# EAGLE design Sensor Acquisition Board Rear rev1 (EAGLE 9.6.2)
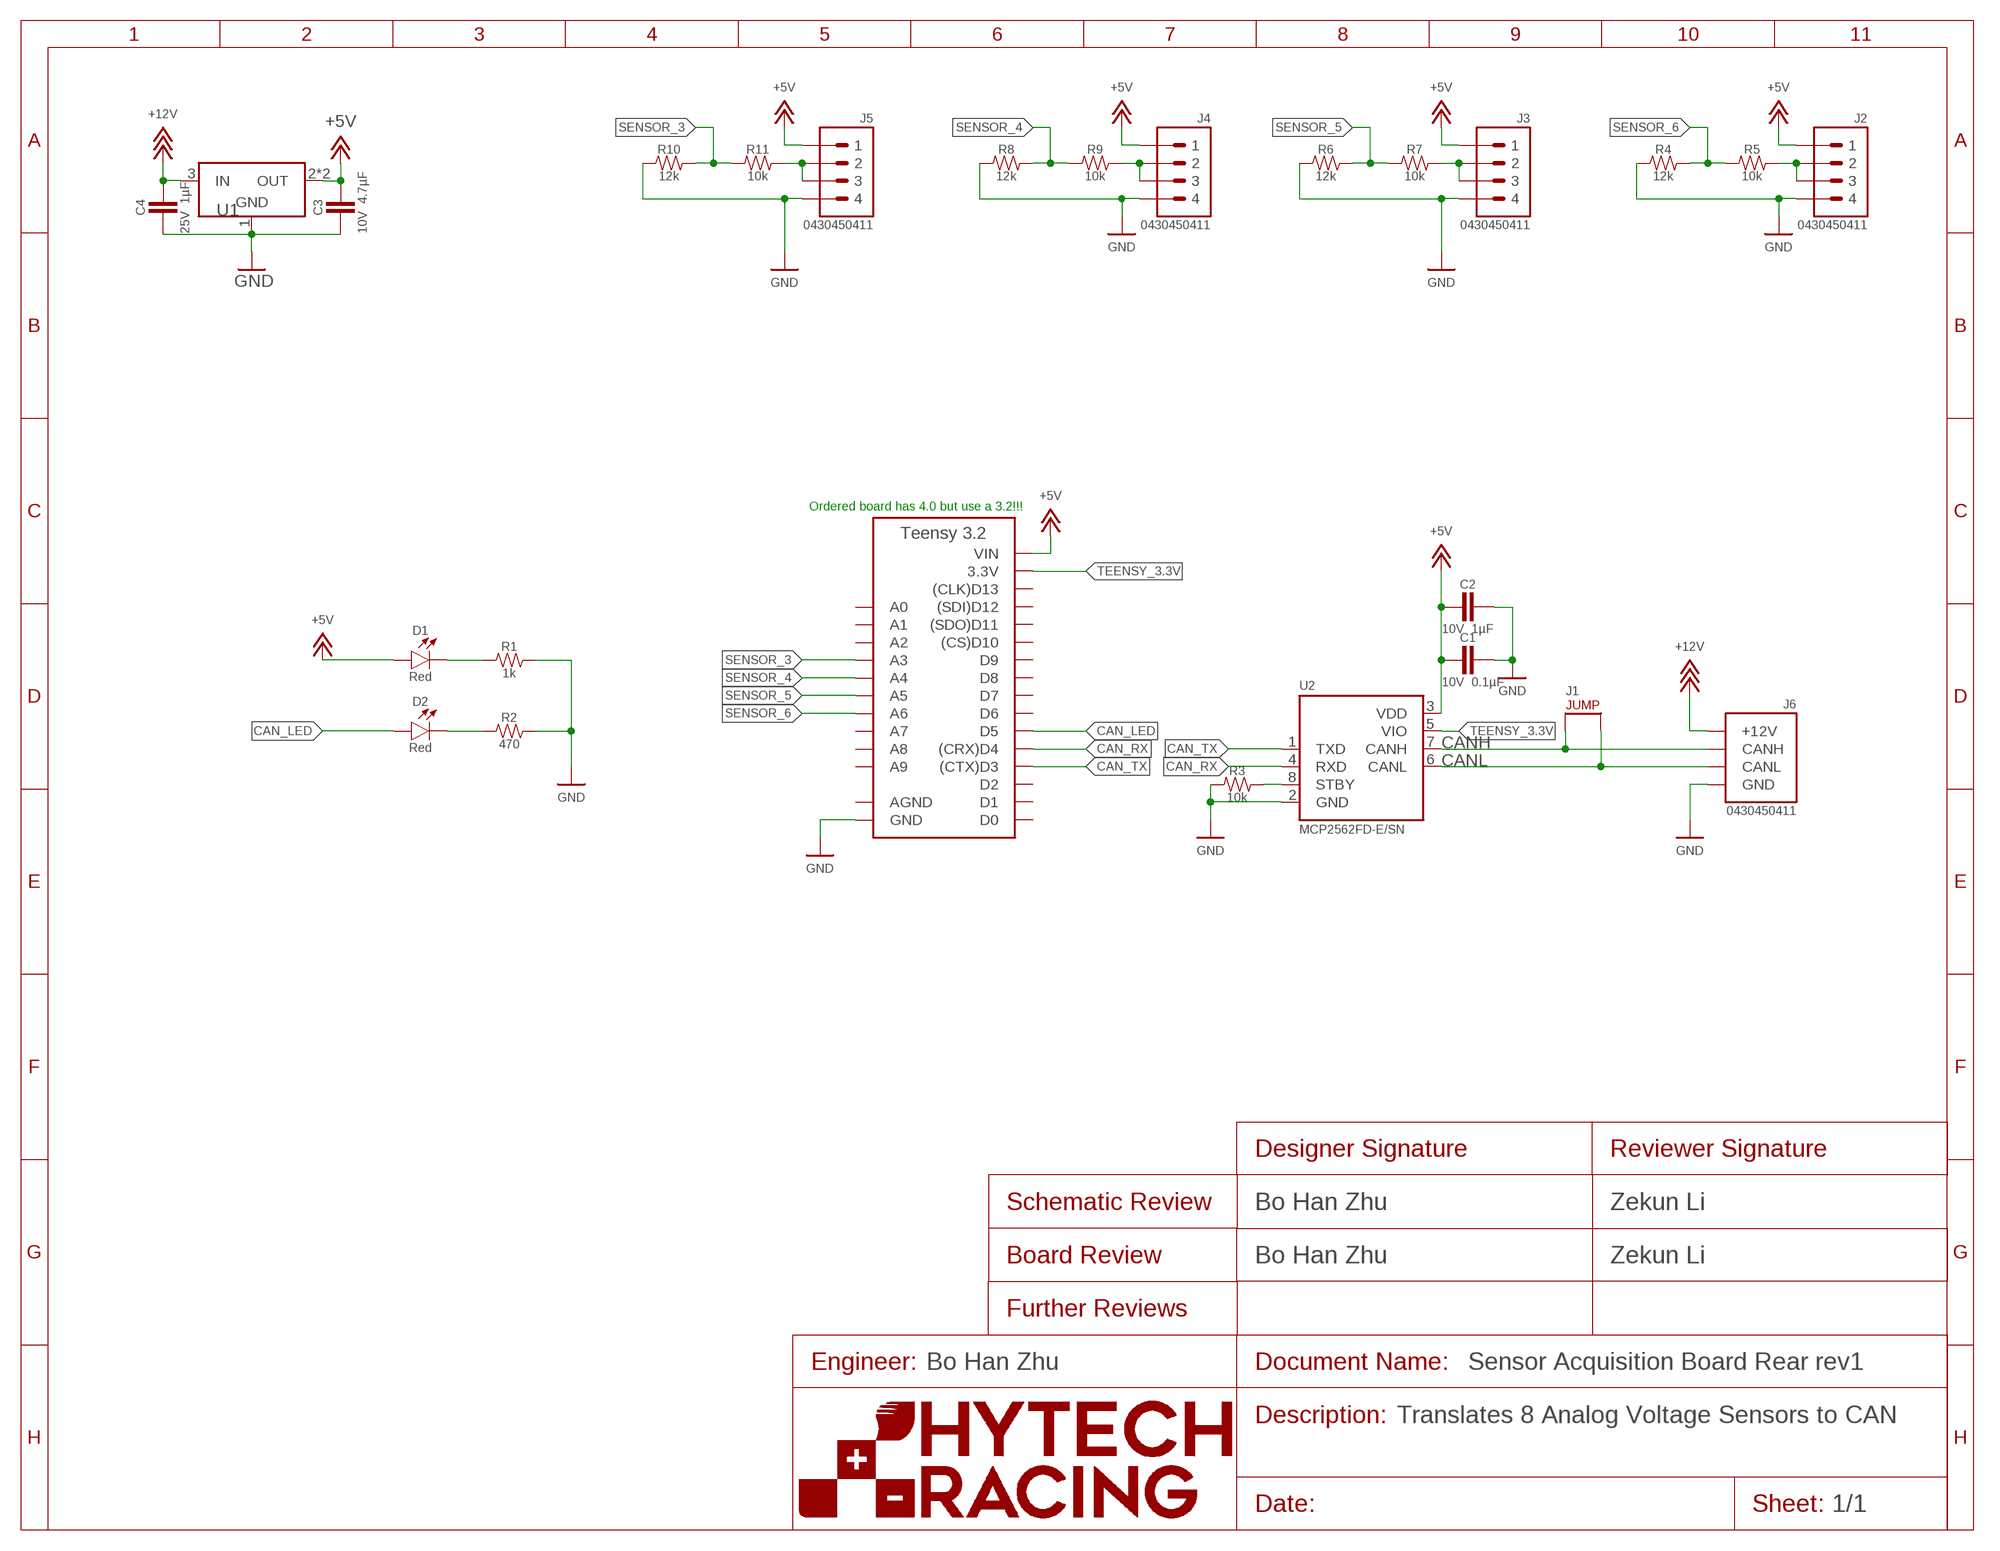
[diagram p0: schematic, sheet 1]
FRAME1 (FRAME): DESCRIPTION_1: Translates 8 Analog Voltage Sensors to CAN; DESIGNER_BOARD: Bo Han Zhu; DESIGNER_SCHEMATIC: Bo Han Zhu; ENGINEER: Bo Han Zhu; REVIEWER_BOARD: Zekun Li; REVIEWER_SCHEMATIC: Zekun Li

## Parts
A1  TEENSY_3.2  [TEENSY_SHORT]
C1  CAPACITOR_0603_10V_0.1UF  [0603-CAP]
C2  CAPACITOR_0603_10V_1UF  [0603-CAP]
C3  CAPACITOR_0603_10V_4.7UF  [0603-CAP]
C4  CAPACITOR_0603_25V_1UF  [0603-CAP]
D1  LED_0603_RED  [0603-LED]
D2  LED_0603_RED  [0603-LED]
J1  JUMPER_0603_  [0603-RES]
J2  CONNECTOR-4_μF_S_RA_  [MOLEX_MICROFIT_SMD_RIGHTANGLE_04_DUAL]
J3  CONNECTOR-4_μF_S_RA_  [MOLEX_MICROFIT_SMD_RIGHTANGLE_04_DUAL]
J4  CONNECTOR-4_μF_S_RA_  [MOLEX_MICROFIT_SMD_RIGHTANGLE_04_DUAL]
J5  CONNECTOR-4_μF_S_RA_  [MOLEX_MICROFIT_SMD_RIGHTANGLE_04_DUAL]
J6  CONNECTOR-CAN_μF_S_RA_  [MOLEX_MICROFIT_SMD_RIGHTANGLE_04_DUAL]
R1  RESISTOR_0603_1K  [0603-RES]
R2  RESISTOR_0603_470  [0603-RES]
R3  RESISTOR_0603_10K  [0603-RES]
R4  RESISTOR_0603_12K  [0603-RES]
R5  RESISTOR_0603_10K  [0603-RES]
R6  RESISTOR_0603_12K  [0603-RES]
R7  RESISTOR_0603_10K  [0603-RES]
R8  RESISTOR_0603_12K  [0603-RES]
R9  RESISTOR_0603_10K  [0603-RES]
R10  RESISTOR_0603_12K  [0603-RES]
R11  RESISTOR_0603_10K  [0603-RES]
U1  VOLTAGE_REGULATOR_SOT-223_5V  [SOT-223]
U2  MCP2562FD  [SOIC-08(NARROW,0.15")]

## Nets
+5V: A1.VIN C1.2 C2.2 C3.1 D1.2(A) J2.1 J3.1 J4.1 J5.1 U1.2(OUT) U1.4(OUT) U2.3(VDD)
+12V: C4.1 J6.1(+12V) U1.3(IN)
CAN_LED: A1.D5 D2.2(A)
CAN_RX: A1.D4((CRX)D4) U2.4(RXD)
CAN_TX: A1.D3((CTX)D3) U2.1(TXD)
CANH: J1.1 J6.4(CANH) U2.7(CANH)
CANL: J1.2 J6.3(CANL) U2.6(CANL)
GND: A1.GND C1.1 C2.1 C3.2 C4.2 J2.4 J3.4 J4.4 J5.4 J6.2(GND) R1.2 R2.2 R3.1 R4.1 R6.1 R8.1 R10.1 U1.1(GND) U2.2(GND)
N$1: D1.1(C) R1.1
N$2: D2.1(C) R2.1
N$3: R3.2 U2.8(STBY)
N$5: J2.2 J2.3 R5.2
N$6: J4.2 J4.3 R9.2
N$7: J3.2 J3.3 R7.2
N$9: J5.2 J5.3 R11.2
SENSOR_3: A1.D17(A3) R10.2 R11.1
SENSOR_4: A1.D18(A4) R8.2 R9.1
SENSOR_5: A1.D19(A5) R6.2 R7.1
SENSOR_6: A1.D20(A6) R4.2 R5.1
TEENSY_3.3V: A1.3.3V U2.5(VIO)
Unconnected: A1.D0 A1.D1 A1.D2 A1.D6 A1.D7 A1.D8 A1.D9 A1.D10((CS)D10) A1.D11((SDO)D11) A1.D12((SDI)D12) A1.D13((CLK)D13) A1.D14(A0) A1.D15(A1) A1.D16(A2) A1.D21(A7) A1.D22(A8) A1.D23(A9)

## Notes on the sheet
- Ordered board has 4.0 but use a 3.2!!!

## Power pins joined to a net without a drawn wire
AGND: A1.AGND/GND(AGND)

## Library data of the parts
A1 = HyTechDevices:TEENSY_3.2: Teensy 3.2 Datasheet <https://www.pjrc.com/store/teensy32.html> Requires ordering of: 2: 14 pin, 0.1" pitch female headers; TEENSY: 3.2
C1 = HyTechDevices:CAPACITOR_?_*: Capacitor, Non-Polarized VJ...1BC Series Datasheet <https://www.mouser.com/datasheet/2/427/vjw1bcbascomseries-1762447.pdf> Samsung Datasheet <https://www.mouser.com/datasheet/2/585/MLCC-1837944.pdf> Walsin Datasheet <https://www.mouser.com/datasheet/2/210/WTC_MLCC_General_Purpose-1534899.pdf> GRM188R61A226ME15D <https://www.mouser.com/datasheet/2/281/1/GRM188R61A226ME15_02A-1985787.pdf> GRM188R61E106MA73D <https://www.mouser.com/datasheet/2/281/1/GRM188R61E106MA73_01A-1985806.pdf> 885012006013 <https://www.mouser.com/datasheet/2/445/885012006013-1726946.pdf> 2220Y6300105KXTWS2 <https://www.mouser.com/datasheet/2/218/SMD_High_and_Std_StackiCap_P62-1825512.pdf> Yageo Class 2, X5R <https://www.mouser.com/datasheet/2/447/UPY_GPHC_X5R_4V_to_50V_26-1827097.pdf> TDK C Series <https://www.mouser.com/ProductDetail/TDK/C3216X5R1V226M160AC?qs=%2Fha2pyFadujbcx9jh7lYl%2F4NeMoXFhdc8AqVWNq4wW6M2y7zl6GzBuhgtI0ngznN> AVX Automotive MLCC <https://www.mouser.com/datasheet/2/40/AutoMLCC-777028.pdf> KEMET X7R Series <https://www.mouser.com/datasheet/2/212/KEM_C1002_X7R_SMD-1102033.pdf> Kyocera AVX <https://www.mouser.com/datasheet/2/40/C0GNP0_Dielectric-951274.pdf>; CAPACITANCE: 0.1µF; DKPN: 720-1688-1-ND; MANUFACTURER: Vishay Vitramon; MOPN: 77-VJ0603Y104JXQPBC; MPN: VJ0603Y104JXQPW1BC; TOLERANCE: 5%; VOLTAGE: 10V
C2 = HyTechDevices:CAPACITOR_?_*: Capacitor, Non-Polarized VJ...1BC Series Datasheet <https://www.mouser.com/datasheet/2/427/vjw1bcbascomseries-1762447.pdf> Samsung Datasheet <https://www.mouser.com/datasheet/2/585/MLCC-1837944.pdf> Walsin Datasheet <https://www.mouser.com/datasheet/2/210/WTC_MLCC_General_Purpose-1534899.pdf> GRM188R61A226ME15D <https://www.mouser.com/datasheet/2/281/1/GRM188R61A226ME15_02A-1985787.pdf> GRM188R61E106MA73D <https://www.mouser.com/datasheet/2/281/1/GRM188R61E106MA73_01A-1985806.pdf> 885012006013 <https://www.mouser.com/datasheet/2/445/885012006013-1726946.pdf> 2220Y6300105KXTWS2 <https://www.mouser.com/datasheet/2/218/SMD_High_and_Std_StackiCap_P62-1825512.pdf> Yageo Class 2, X5R <https://www.mouser.com/datasheet/2/447/UPY_GPHC_X5R_4V_to_50V_26-1827097.pdf> TDK C Series <https://www.mouser.com/ProductDetail/TDK/C3216X5R1V226M160AC?qs=%2Fha2pyFadujbcx9jh7lYl%2F4NeMoXFhdc8AqVWNq4wW6M2y7zl6GzBuhgtI0ngznN> AVX Automotive MLCC <https://www.mouser.com/datasheet/2/40/AutoMLCC-777028.pdf> KEMET X7R Series <https://www.mouser.com/datasheet/2/212/KEM_C1002_X7R_SMD-1102033.pdf> Kyocera AVX <https://www.mouser.com/datasheet/2/40/C0GNP0_Dielectric-951274.pdf>; CAPACITANCE: 1µF; DKPN: 311-1796-1-ND; MANUFACTURER: Yageo; MOPN: 603-CC603KRX7R6BB105; MPN: CC0603KRX7R6BB105; TOLERANCE: 10%; VOLTAGE: 10V
C3 = HyTechDevices:CAPACITOR_?_*: Capacitor, Non-Polarized VJ...1BC Series Datasheet <https://www.mouser.com/datasheet/2/427/vjw1bcbascomseries-1762447.pdf> Samsung Datasheet <https://www.mouser.com/datasheet/2/585/MLCC-1837944.pdf> Walsin Datasheet <https://www.mouser.com/datasheet/2/210/WTC_MLCC_General_Purpose-1534899.pdf> GRM188R61A226ME15D <https://www.mouser.com/datasheet/2/281/1/GRM188R61A226ME15_02A-1985787.pdf> GRM188R61E106MA73D <https://www.mouser.com/datasheet/2/281/1/GRM188R61E106MA73_01A-1985806.pdf> 885012006013 <https://www.mouser.com/datasheet/2/445/885012006013-1726946.pdf> 2220Y6300105KXTWS2 <https://www.mouser.com/datasheet/2/218/SMD_High_and_Std_StackiCap_P62-1825512.pdf> Yageo Class 2, X5R <https://www.mouser.com/datasheet/2/447/UPY_GPHC_X5R_4V_to_50V_26-1827097.pdf> TDK C Series <https://www.mouser.com/ProductDetail/TDK/C3216X5R1V226M160AC?qs=%2Fha2pyFadujbcx9jh7lYl%2F4NeMoXFhdc8AqVWNq4wW6M2y7zl6GzBuhgtI0ngznN> AVX Automotive MLCC <https://www.mouser.com/datasheet/2/40/AutoMLCC-777028.pdf> KEMET X7R Series <https://www.mouser.com/datasheet/2/212/KEM_C1002_X7R_SMD-1102033.pdf> Kyocera AVX <https://www.mouser.com/datasheet/2/40/C0GNP0_Dielectric-951274.pdf>; CAPACITANCE: 4.7µF; DKPN: 1276-1044-1-ND; MANUFACTURER: Samsung Electro-Mechanics; MOPN: 187-CL10A475KP8NNNC; MPN: CL10A475KP8NNNC; TOLERANCE: 10%; VOLTAGE: 10V
C4 = HyTechDevices:CAPACITOR_?_*: Capacitor, Non-Polarized VJ...1BC Series Datasheet <https://www.mouser.com/datasheet/2/427/vjw1bcbascomseries-1762447.pdf> Samsung Datasheet <https://www.mouser.com/datasheet/2/585/MLCC-1837944.pdf> Walsin Datasheet <https://www.mouser.com/datasheet/2/210/WTC_MLCC_General_Purpose-1534899.pdf> GRM188R61A226ME15D <https://www.mouser.com/datasheet/2/281/1/GRM188R61A226ME15_02A-1985787.pdf> GRM188R61E106MA73D <https://www.mouser.com/datasheet/2/281/1/GRM188R61E106MA73_01A-1985806.pdf> 885012006013 <https://www.mouser.com/datasheet/2/445/885012006013-1726946.pdf> 2220Y6300105KXTWS2 <https://www.mouser.com/datasheet/2/218/SMD_High_and_Std_StackiCap_P62-1825512.pdf> Yageo Class 2, X5R <https://www.mouser.com/datasheet/2/447/UPY_GPHC_X5R_4V_to_50V_26-1827097.pdf> TDK C Series <https://www.mouser.com/ProductDetail/TDK/C3216X5R1V226M160AC?qs=%2Fha2pyFadujbcx9jh7lYl%2F4NeMoXFhdc8AqVWNq4wW6M2y7zl6GzBuhgtI0ngznN> AVX Automotive MLCC <https://www.mouser.com/datasheet/2/40/AutoMLCC-777028.pdf> KEMET X7R Series <https://www.mouser.com/datasheet/2/212/KEM_C1002_X7R_SMD-1102033.pdf> Kyocera AVX <https://www.mouser.com/datasheet/2/40/C0GNP0_Dielectric-951274.pdf>; CAPACITANCE: 1µF; DKPN: 1276-1184-1-ND; MANUFACTURER: Samsung Electro-Mechanics; MOPN: 187-CL10B105KA8NNNC; MPN: CL10B105KA8NNNC; TOLERANCE: 10%; VOLTAGE: 25V
D1 D2 = HyTechDevices:LED_?_*: LED 0603 Blue <https://www.mouser.com/datasheet/2/216/APT1608VBC_D-246010.pdf> Green <https://www.mouser.com/datasheet/2/216/APT1608ZGCK-1173388.pdf> Orange <https://www.mouser.com/datasheet/2/216/APT1608SECK-6197.pdf> Red <https://www.mouser.com/datasheet/2/216/APT1608SECK-J3-PRV-1173336.pdf> White <https://www.mouser.com/datasheet/2/50/SM0603UWC-880813.pdf> Yellow <https://www.mouser.com/datasheet/2/216/APT1608SYCK-J3-PRV-1173311.pdf> 2835 (Series not on Digikey) Lumiled LUXEON 2835 Color Line <https://www.mouser.com/datasheet/2/602/DS236_luxeon_2835_color_line_datasheet-1596094.pdf>; COLOR: Red; DKPN: 754-1786-1-ND; MANUFACTURER: Kingbright; MOPN: 604-APT1608SECKJ3PRV; MPN: APT1608SECK/J3-PRV
J1 = HyTechDevices:JUMPER_?_*: 2 Pin Connector; DKPN: 13-RC0603FR-130RLTR-ND; MANUFACTURER: YAGEO; MOPN: 603-RC0603FR-130RL; MPN: RC0603FR-130RL
J2-J5 = HyTechDevices:CONNECTOR-4_?_*; DKPN: WM1832CT-ND; MANUFACTURER: Molex; MOPN: 538-0430450411; MPN: 0430450411
J6 = HyTechDevices:CONNECTOR-CAN_?_*: HyTech CAN Connector; DKPN: WM1832CT-ND; MANUFACTURER: Molex; MOPN: 538-43045-0411; MPN: 0430450411
R1 = HyTechDevices:RESISTOR_?_*: Resistor PWR163 Series <https://www.mouser.com/datasheet/2/54/pwr163-777985.pdf> AC Series <https://www.mouser.com/datasheet/2/447/Yageo_PYu_AC_51_RoHS_L_7_1714230-1874691.pdf> PU Series <https://www.mouser.com/datasheet/2/447/PYu-PU_51_RoHS_L_6-1504619.pdf> ERA Series <https://www.mouser.com/datasheet/2/315/AOA0000C307-1149632.pdf> PWR263 Series <https://www.mouser.com/datasheet/2/54/pwr263s_35-778069.pdf> RC Series <https://www.mouser.com/datasheet/2/447/Yageo_03_18_2021_PYu_RC_Group_51_RoHS_L_11-2199992.pdf> ERJ PB3, PB6 Series <https://www.mouser.com/datasheet/2/315/AOA0000C328-1530132.pdf> ERJ PA2, P03, PA3, P06, P08, P14 Series <https://www.mouser.com/datasheet/2/315/AOA0000C331-1141874.pdf>; DKPN: 311-1.00KHRCT-ND; MANUFACTURER: Yageo; MOPN: 603-RC0603FR-071KL; MPN: RC0603FR-071KL; POWER: 0.1W; RESISTANCE: 1k; TOLERANCE: 1%; VOLTAGE_CONTINUOUS: 10.00V; VOLTAGE_MAX: 75V
R2 = HyTechDevices:RESISTOR_?_*: Resistor PWR163 Series <https://www.mouser.com/datasheet/2/54/pwr163-777985.pdf> AC Series <https://www.mouser.com/datasheet/2/447/Yageo_PYu_AC_51_RoHS_L_7_1714230-1874691.pdf> PU Series <https://www.mouser.com/datasheet/2/447/PYu-PU_51_RoHS_L_6-1504619.pdf> ERA Series <https://www.mouser.com/datasheet/2/315/AOA0000C307-1149632.pdf> PWR263 Series <https://www.mouser.com/datasheet/2/54/pwr263s_35-778069.pdf> RC Series <https://www.mouser.com/datasheet/2/447/Yageo_03_18_2021_PYu_RC_Group_51_RoHS_L_11-2199992.pdf> ERJ PB3, PB6 Series <https://www.mouser.com/datasheet/2/315/AOA0000C328-1530132.pdf> ERJ PA2, P03, PA3, P06, P08, P14 Series <https://www.mouser.com/datasheet/2/315/AOA0000C331-1141874.pdf>; DKPN: P470BYCT-ND; MANUFACTURER: Panasonic Electronic Components; MOPN: 667-ERJ-PA3F4700V; MPN: ERJ-PA3F4700V; POWER: 0.25W; RESISTANCE: 470; TOLERANCE: 1%; VOLTAGE_CONTINUOUS: 10.84V; VOLTAGE_MAX: 150V
R3 R5 R7 R9 R11 = HyTechDevices:RESISTOR_?_*: Resistor PWR163 Series <https://www.mouser.com/datasheet/2/54/pwr163-777985.pdf> AC Series <https://www.mouser.com/datasheet/2/447/Yageo_PYu_AC_51_RoHS_L_7_1714230-1874691.pdf> PU Series <https://www.mouser.com/datasheet/2/447/PYu-PU_51_RoHS_L_6-1504619.pdf> ERA Series <https://www.mouser.com/datasheet/2/315/AOA0000C307-1149632.pdf> PWR263 Series <https://www.mouser.com/datasheet/2/54/pwr263s_35-778069.pdf> RC Series <https://www.mouser.com/datasheet/2/447/Yageo_03_18_2021_PYu_RC_Group_51_RoHS_L_11-2199992.pdf> ERJ PB3, PB6 Series <https://www.mouser.com/datasheet/2/315/AOA0000C328-1530132.pdf> ERJ PA2, P03, PA3, P06, P08, P14 Series <https://www.mouser.com/datasheet/2/315/AOA0000C331-1141874.pdf>; DKPN: 311-10.0KHRCT-ND; MANUFACTURER: Yageo; MOPN: 603-RC0603FR-0710KL; MPN: RC0603FR-0710KL; POWER: 0.1W; RESISTANCE: 10k; TOLERANCE: 1%; VOLTAGE_CONTINUOUS: 31.62V; VOLTAGE_MAX: 75V
R4 R6 R8 R10 = HyTechDevices:RESISTOR_?_*: Resistor PWR163 Series <https://www.mouser.com/datasheet/2/54/pwr163-777985.pdf> AC Series <https://www.mouser.com/datasheet/2/447/Yageo_PYu_AC_51_RoHS_L_7_1714230-1874691.pdf> PU Series <https://www.mouser.com/datasheet/2/447/PYu-PU_51_RoHS_L_6-1504619.pdf> ERA Series <https://www.mouser.com/datasheet/2/315/AOA0000C307-1149632.pdf> PWR263 Series <https://www.mouser.com/datasheet/2/54/pwr263s_35-778069.pdf> RC Series <https://www.mouser.com/datasheet/2/447/Yageo_03_18_2021_PYu_RC_Group_51_RoHS_L_11-2199992.pdf> ERJ PB3, PB6 Series <https://www.mouser.com/datasheet/2/315/AOA0000C328-1530132.pdf> ERJ PA2, P03, PA3, P06, P08, P14 Series <https://www.mouser.com/datasheet/2/315/AOA0000C331-1141874.pdf>; DKPN: 311-12.0KHRCT-ND; MANUFACTURER: Yageo; MOPN: 603-RC0603FR-0712KL; MPN: RC0603FR-0712KL; POWER: 0.1W; RESISTANCE: 12k; TOLERANCE: 1%; VOLTAGE_CONTINUOUS: 34.64V; VOLTAGE_MAX: 75V
U1 = HyTechDevices:VOLTAGE_REGULATOR_?_*: Voltage Regulators LDL1117S50R Datasheet <https://www.mouser.com/datasheet/2/389/dm00366442-1799212.pdf> NCP785AH120T1G <https://www.mouser.com/datasheet/2/308/NCP785A_D-1812704.pdf> LMS8117A Datasheet <https://www.ti.com/lit/ds/symlink/lms8117a.pdf?HQS>; DKPN: 497-17240-1-ND; MANUFACTURER: STMicroelectronics; MOPN: 511-LDL1117S50R; MPN: LDL1117S50R
U2 = HyTechDevices:MCP2562FD: MCP2562FD Can Tranciever Datasheet <https://ww1.microchip.com/downloads/en/DeviceDoc/20005284A.pdf>; ALT_DKPN: MCP2562-E/SN-ND; ALT_MANUFACTURER: Microchip Technology; ALT_MOPN: 579-MCP2562-E/SN; ALT_MPN: MCP2562-E/SN; DKPN: MCP2562FD-E/SN-ND; MANUFACTURER: Microchip Technology; MOPN: 579-MCP2562FD-E/SN; MPN: MCP2562FD-E/SN

## Board
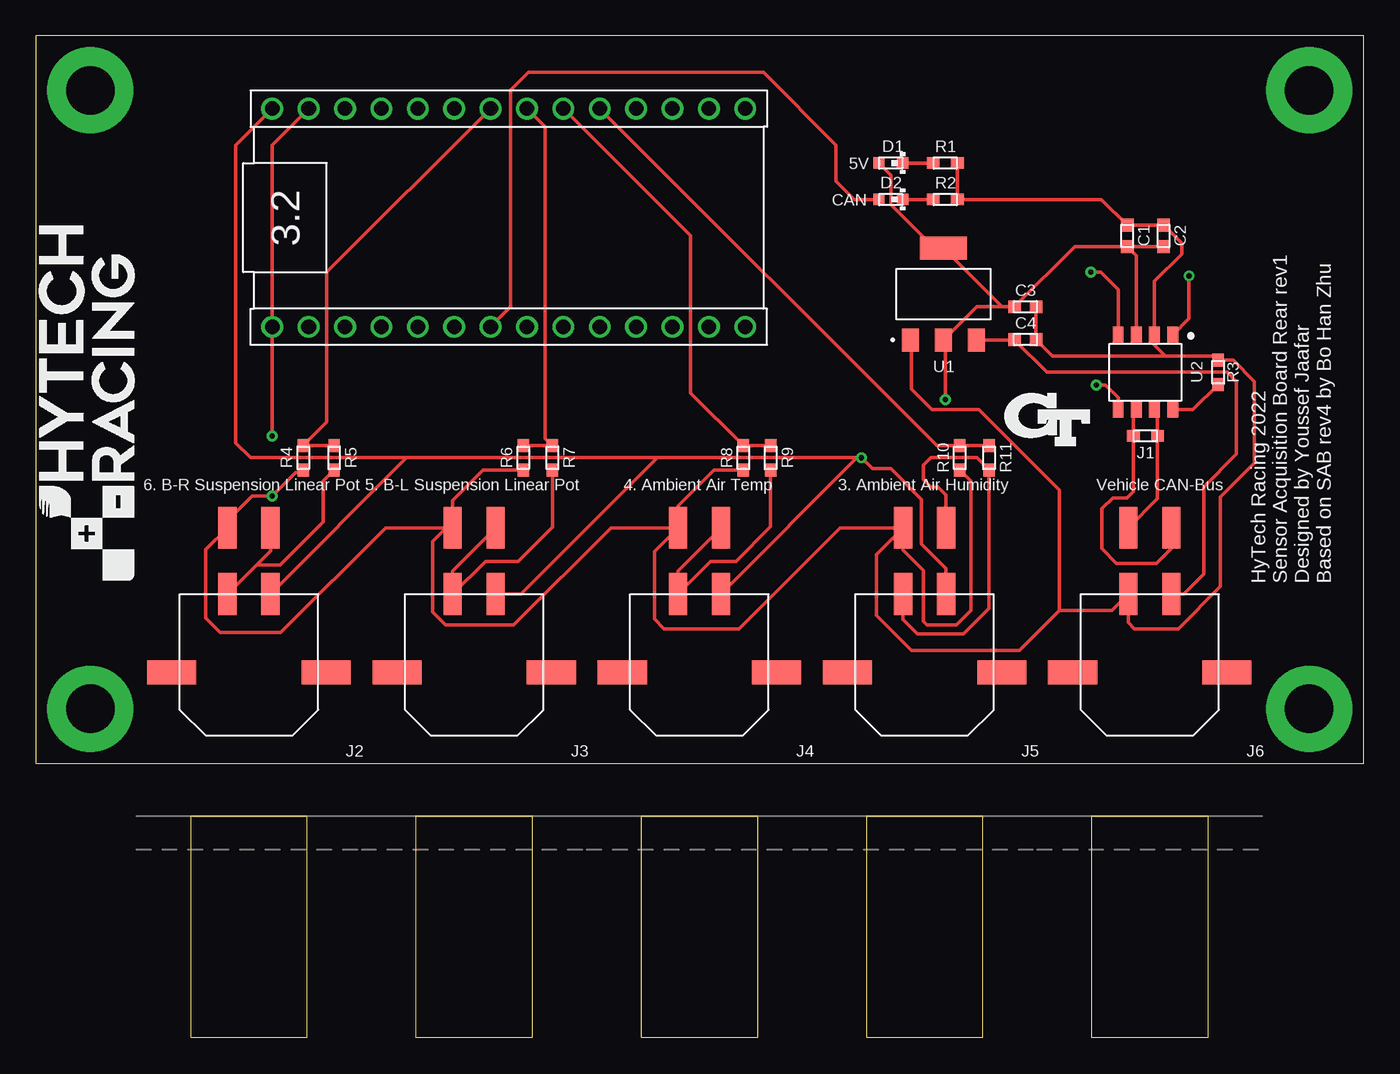
[diagram p1: board, top side]
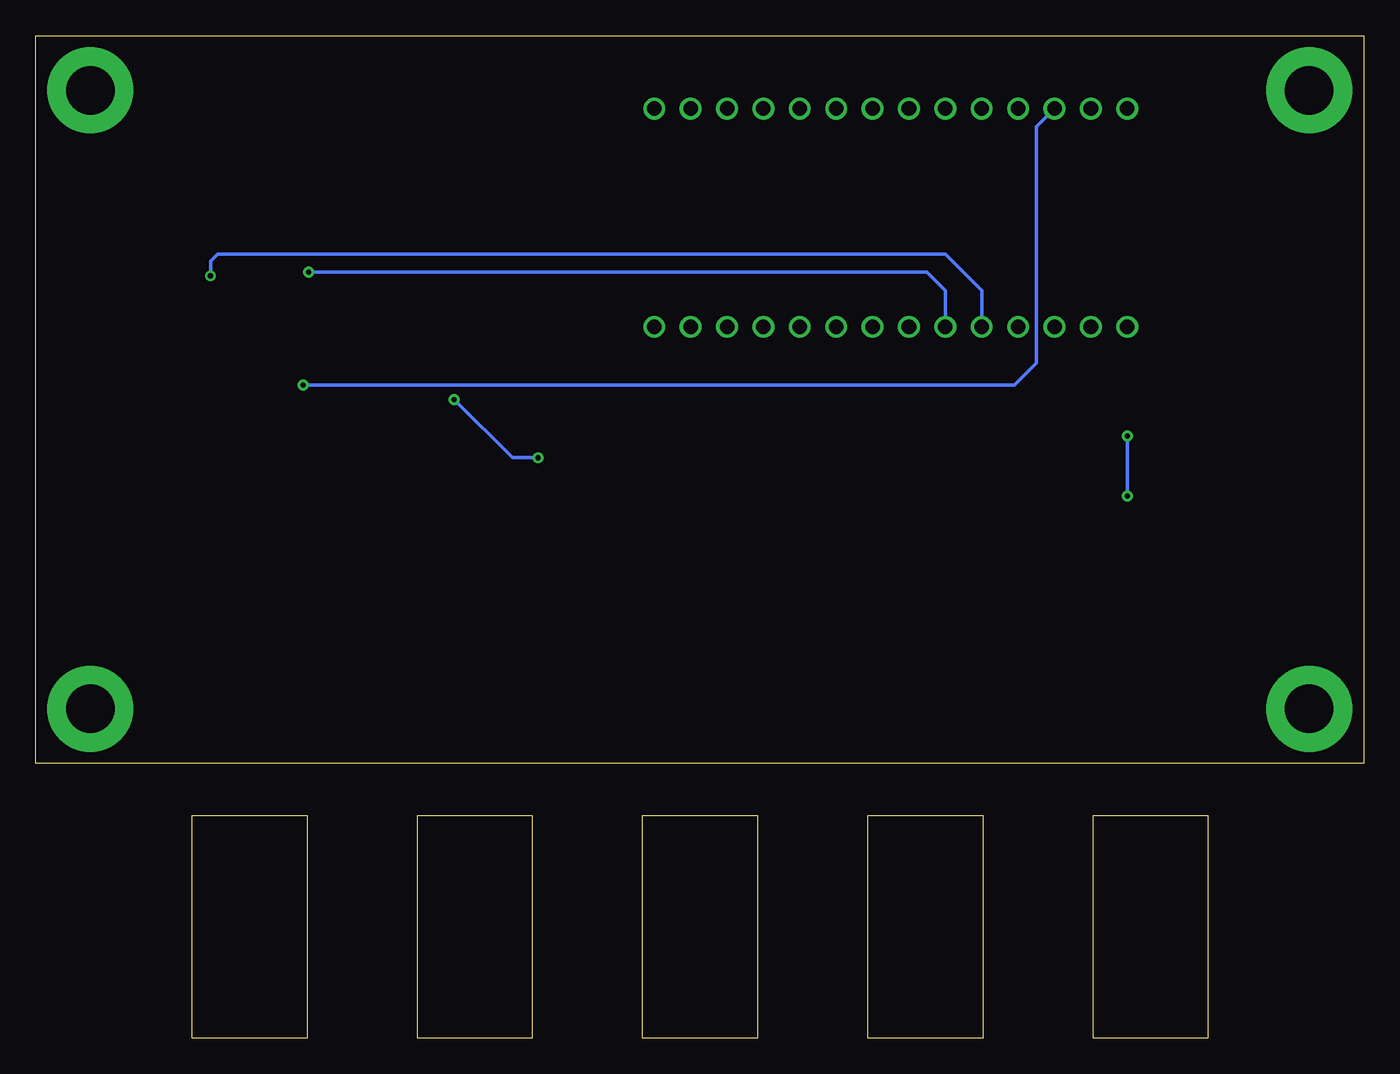
[diagram p2: board, bottom side, seen from below]

Size 92.71 x 50.8 mm. Coordinates in mm from the lower left corner, seen from the top.
Outline: 0,0 92.71,0 92.71,50.8 0,50.8 0,0
Copper layers (1*16): Top 0.035mm / dielectric 1.53mm / Bottom 0.035mm
Design rules "HyTech Default (2 Layer)": minimum track width 6mil, minimum drill 14mil, track to track 6mil, track to pad 6mil, pad to pad 6mil, via to via 20mil, smd to smd 6mil, copper to edge 20mil, drill to drill 21mil, minimum pad ring 7mil, minimum via ring 8mil, stop-mask expansion 6mil, vias tented up to drill 30mil, thermal gap 10mil

### Footprints (pad centres in the part's own frame; a part is rotated, then mirrored left to right if it is on the bottom)
MOUNTING_M3 = drill 3.4 pad 6: 1 0,0
TEENSY_SHORT = drill 1.016: 3.3V 0,5.08; AGND/GND 0,2.54; D0 15.24,2.54; D1 15.24,5.08; D2 15.24,7.62; D3 15.24,10.16; D4 15.24,12.7; D5 15.24,15.24; D6 15.24,17.78; D7 15.24,20.32; D8 15.24,22.86; D9 15.24,25.4; D10 15.24,27.94; D11 15.24,30.48; D12 15.24,33.02; D13 0,33.02; D14 0,30.48; D15 0,27.94; D16 0,25.4; D17 0,22.86; D18 0,20.32; D19 0,17.78; D20 0,15.24; D21 0,12.7; D22 0,10.16; D23 0,7.62; GND 15.24,0; VIN 0,0
0603-CAP = smd 0.9 x 0.9: 1 -0.75,0; 2 0.75,0
0603-LED = smd 0.8 x 0.8: 1 -0.825,0; 2 0.825,0
0603-RES = smd 0.9 x 0.8: 1 -0.85,0; 2 0.85,0
MOLEX_MICROFIT_SMD_RIGHTANGLE_04_DUAL = smd 1.27 x 2.921: 1 1.5,5.474; 2 -1.5,5.474; 3 1.5,10.097; 4 -1.5,10.097 | smd 3.429 x 1.651: PAD1 5.386,0; PAD2 -5.386,0
SOT-223 = smd 1.2 x 1.6: 1 -2.3,-3.2; 2 0,-3.2; 3 2.3,-3.2 | smd 3.3 x 1.6: 4 0,3.2
SOIC-08(NARROW,0.15") = smd 0.762 x 1.143: 1 -1.905,-2.603; 2 -0.635,-2.603; 3 0.635,-2.603; 4 1.905,-2.603; 5 1.905,2.603; 6 0.635,2.603; 7 -0.635,2.603; 8 -1.905,2.603

### Placement (x,y rotation side)
$$U$6  [MOUNTING_M3]  88.9,3.81 0 top
A1  16.51,45.72 270 top
C1  76.2,36.83 270 top
C2  78.74,36.83 270 top
C3  69.09,31.88 0 top
C4  69.09,29.59 0 top
D1  59.69,41.91 180 top
D2  59.69,39.37 180 top
J1  77.47,22.86 180 top
J2  14.88,6.35 0 top
J3  30.61,6.35 0 top
J4  46.33,6.35 0 top
J5  62.05,6.35 0 top
J6  77.77,6.35 0 top
R1  63.5,41.91 0 top
R2  63.5,39.37 0 top
R3  82.55,27.3 270 top
R4  18.67,21.34 90 top
R5  20.83,21.34 270 top
R6  34.04,21.34 90 top
R7  36.07,21.34 270 top
R8  49.4,21.34 90 top
R9  51.31,21.34 270 top
R10  64.52,21.34 90 top
R11  66.55,21.34 270 top
U1  63.37,32.77 0 top
U2  77.47,27.3 180 top
U$1  [MOUNTING_M3]  3.81,46.99 0 top
U$2  [MOUNTING_M3]  88.9,46.99 0 top
U$3  [LOGO_GT_0.25"]  70.61,24 0 top
U$4  [LOGO_HYTECH_MEDIUM]  6.86,12.7 90 top
U$5  [MOUNTING_M3]  3.81,3.81 0 top

### Tracks (layer width: path | path; a pad name or v marks a point on that pad's centre or on a via)
+5V  (via drill 0.36)
  Top 0.254: A1.VIN 13.97,43.18 13.97,22.35 14.99,21.34 25.9,21.34 | J3.1 33.88,11.82 43.4,21.34 | C2.2 C1.2 | D1.2 59.69,41.09 59.69,39 62.72,35.97 U1.4 67.45,31.89 | 67.45,31.89 67.46,31.88 C3.1 72.54,36.08 C1.2 | v63.5,25.4 63.5,29.44 U1.2 65.7,31.89 67.45,31.89 | U2.3 76.83,35.45 C1.2 | 57.34,21.34 v57.66,21.34 58.42,20.57 59.69,20.57 61.83,18.43 61.83,15.32 63.55,13.6 J5.1 | 57.34,21.34 43.4,21.34 | 43.4,21.34 25.9,21.34 | J4.1 57.34,21.34 | J2.1 25.9,21.34
  Bottom 0.254: v63.5,25.4 59.44,21.34 v57.66,21.34
+12V
  Top 0.254: U1.3 68.31,29.57 | 68.31,29.57 C4.1 | 68.31,29.57 70.57,27.3 83.19,27.3 83.82,26.67 83.82,21.59 81.53,19.3 81.53,13.21 80.15,11.82 J6.1
CAN_LED
  Top 0.254: A1.D5 33.15,31.88 33.15,46.99 34.42,48.26 50.8,48.26 55.88,43.18 55.88,40.64 57.15,39.37 D2.2
CAN_RX  (via drill 0.36)
  Top 0.254: v73.66,34.29 74.36,34.29 75.56,33.08 U2.4
  Bottom 0.254: A1.D4 29.21,33.02 30.48,34.29 v73.66,34.29
CAN_TX  (via drill 0.36)
  Top 0.254: U2.1 80.52,31.05 v80.52,34.04
  Bottom 0.254: A1.D3 26.67,33.02 29.21,35.56 80.01,35.56 80.52,35.05 v80.52,34.04
CANH
  Top 0.254: U2.7 78.32,24.49 J1.1 78.32,18.49 J6.4
CANL
  Top 0.254: U2.6 76.62,24.49 J1.2 76.62,18.97 76.19,18.54 75.18,18.54 74.42,17.78 74.42,14.99 75.44,13.97 78.23,13.97 79.28,15.01 J6.3
GND  (via drill 0.36)
  Top 0.254: R4.1 18.67,20.32 18.16,20.32 v16.5,18.67 15.11,18.67 13.38,16.94 J2.4 11.86,14.92 11.86,10.15 12.87,9.14 17.1,9.14 24.41,16.45 J3.4 | J3.4 29.11,18.35 31.24,20.49 R6.1 | J3.4 28.64,16.45 27.69,15.49 27.69,10.58 28.62,9.65 33.36,9.65 40.15,16.45 J4.4 | R8.1 47.34,20.49 44.83,17.97 J4.4 | J4.4 43.18,14.8 43.18,10.07 43.86,9.4 49.11,9.4 56.16,16.45 J5.4 60.53,16.43 | R10.1 65.28,19.72 65.28,10.67 64.26,9.65 62.23,9.65 61.98,9.91 61.98,13.46 60.53,14.9 60.53,16.43 | 71.46,10.67 68.67,7.87 61.13,7.87 58.67,10.33 58.67,14.57 60.53,16.43 | 71.46,10.67 71.46,19.09 65.86,24.69 62.57,24.69 61.14,26.12 61.14,29.5 U1.1 | v16.51,22.86 A1.GND 16.51,43.18 19.05,45.72 | R1.2 R2.2 74.41,39.37 C1.1 C2.1 80.01,36.31 80.01,35.56 78.11,33.66 U2.2 78.11,29.21 78.87,28.45 | C3.2 C4.2 70.98,28.45 78.87,28.45 | 78.87,28.45 82.26,28.45 R3.1 83.61,28.16 85.09,26.67 85.09,20.98 82.7,18.59 82.7,12.34 79.76,9.4 76.71,9.4 76.28,9.83 J6.2 75.12,10.67 71.46,10.67
  Bottom 0.254: v16.51,22.86 v16.51,18.67 v16.5,18.67
N$1
  Top 0.254: D1.1 R1.1
N$2
  Top 0.254: R2.1 D2.1
N$3
  Top 0.254: U2.8 80.8,24.7 R3.2
N$5
  Top 0.254: R5.2 20.07,19.72 20.07,16.86 17.06,13.86 15.42,13.86 J2.2 16.38,14.82 J2.3
N$6
  Top 0.254: J4.3 44.83,13.45 J4.2 47.12,14.11 48.89,14.11 51.31,16.52 R9.2
N$7
  Top 0.254: J3.3 29.11,13.45 J3.2 31.39,14.11 33.68,14.11 36.07,16.5 R7.2
N$9
  Top 0.254: J5.3 63.55,18.74 62.99,19.3 62.48,19.3 61.98,19.81 61.98,20.83 62.48,21.34 65.7,21.34 R11.2 66.55,10.81 64.77,9.03 61.57,9.03 60.55,10.05 J5.2
SENSOR_3
  Top 0.254: R11.1 R10.2 62.9,22.19 A1.D17
SENSOR_4
  Top 0.254: A1.D18 45.72,36.83 45.72,25.87 R8.2 R9.1
SENSOR_5
  Top 0.254: A1.D19 35.56,44.45 35.56,22.69 R7.1 R6.2
SENSOR_6
  Top 0.254: R5.1 R4.2 20.32,23.84 20.32,34.29 A1.D20
TEENSY_3.3V  (via drill 0.36)
  Top 0.254: U2.5 75.56,25.53 74.68,26.42 v74.04,26.42
  Bottom 0.254: v74.04,26.42 24.38,26.42 22.86,27.94 22.86,44.45 A1.3.3V

### Text on the board
tPlace: 5V | CAN | 3.2 | 6. B-R Suspension Linear Pot | 5. B-L Suspension Linear Pot | 4. Ambient Air Temp | 3. Ambient Air Humidity | Vehicle CAN-Bus | HyTech Racing 2022 / Sensor Acquisition Board Rear rev1 / Designed by Youssef Jaafar / Based on SAB rev4 by Bo Han Zhu